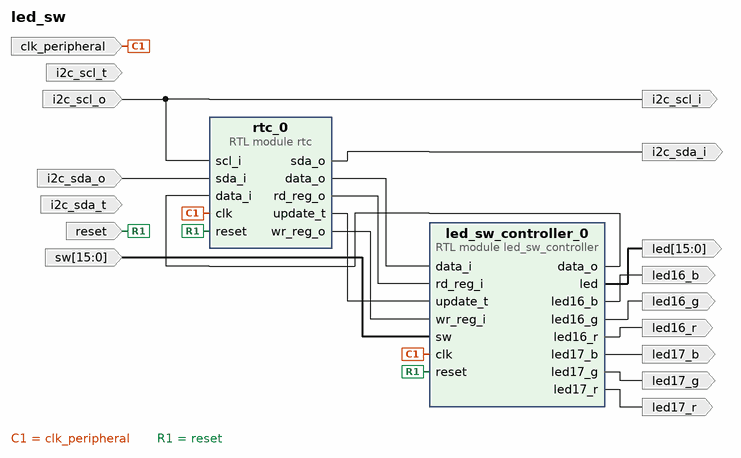
[diagram p0: block diagram of the top level]
# Vivado block design led_sw, xc7a100tcsg324-1, Vivado 2021.2
create_bd_design led_sw

create_bd_port -dir I -type clk clk_peripheral
set_property -dict {CONFIG.FREQ_HZ 28000000} [get_bd_ports clk_peripheral]
create_bd_port -dir O i2c_scl_i
create_bd_port -dir I i2c_scl_o
create_bd_port -dir I i2c_scl_t
create_bd_port -dir O i2c_sda_i
create_bd_port -dir I i2c_sda_o
create_bd_port -dir I i2c_sda_t
create_bd_port -dir O -from 15 -to 0 led
create_bd_port -dir O led16_b
create_bd_port -dir O led16_g
create_bd_port -dir O led16_r
create_bd_port -dir O led17_b
create_bd_port -dir O led17_g
create_bd_port -dir O led17_r
create_bd_port -dir I -type rst reset
set_property -dict {CONFIG.POLARITY ACTIVE_HIGH} [get_bd_ports reset]
create_bd_port -dir I -from 15 -to 0 sw

create_bd_cell -type module -reference led_sw_controller led_sw_controller_0
create_bd_cell -type module -reference rtc rtc_0
set_property -dict {CONFIG.DEVICE_ID {"1011000"}} [get_bd_cells rtc_0]

# ---- connections ----

connect_bd_net [get_bd_ports clk_peripheral] [get_bd_pins led_sw_controller_0/clk] [get_bd_pins rtc_0/clk]
connect_bd_net [get_bd_ports reset] [get_bd_pins led_sw_controller_0/reset] [get_bd_pins rtc_0/reset]
connect_bd_net [get_bd_ports i2c_scl_o] [get_bd_ports i2c_scl_i] [get_bd_pins rtc_0/scl_i]
connect_bd_net [get_bd_ports i2c_sda_o] [get_bd_pins rtc_0/sda_i]
connect_bd_net [get_bd_pins led_sw_controller_0/data_o] [get_bd_pins rtc_0/data_i]
connect_bd_net [get_bd_pins led_sw_controller_0/led] [get_bd_ports led]
connect_bd_net [get_bd_pins led_sw_controller_0/led16_b] [get_bd_ports led16_b]
connect_bd_net [get_bd_pins led_sw_controller_0/led16_g] [get_bd_ports led16_g]
connect_bd_net [get_bd_pins led_sw_controller_0/led16_r] [get_bd_ports led16_r]
connect_bd_net [get_bd_pins led_sw_controller_0/led17_b] [get_bd_ports led17_b]
connect_bd_net [get_bd_pins led_sw_controller_0/led17_g] [get_bd_ports led17_g]
connect_bd_net [get_bd_pins led_sw_controller_0/led17_r] [get_bd_ports led17_r]
connect_bd_net [get_bd_pins rtc_0/data_o] [get_bd_pins led_sw_controller_0/data_i]
connect_bd_net [get_bd_pins rtc_0/rd_reg_o] [get_bd_pins led_sw_controller_0/rd_reg_i]
connect_bd_net [get_bd_pins rtc_0/sda_o] [get_bd_ports i2c_sda_i]
connect_bd_net [get_bd_pins rtc_0/update_t] [get_bd_pins led_sw_controller_0/update_t]
connect_bd_net [get_bd_pins rtc_0/wr_reg_o] [get_bd_pins led_sw_controller_0/wr_reg_i]
connect_bd_net [get_bd_ports sw] [get_bd_pins led_sw_controller_0/sw]

validate_bd_design
save_bd_design
